# Altium schematic sheet PCB_BERRACHED_ZAKARIA_SCHELA_ELECTRIQUE.SchDoc
size A4; SheetNumber: 1; SheetTotal: 1
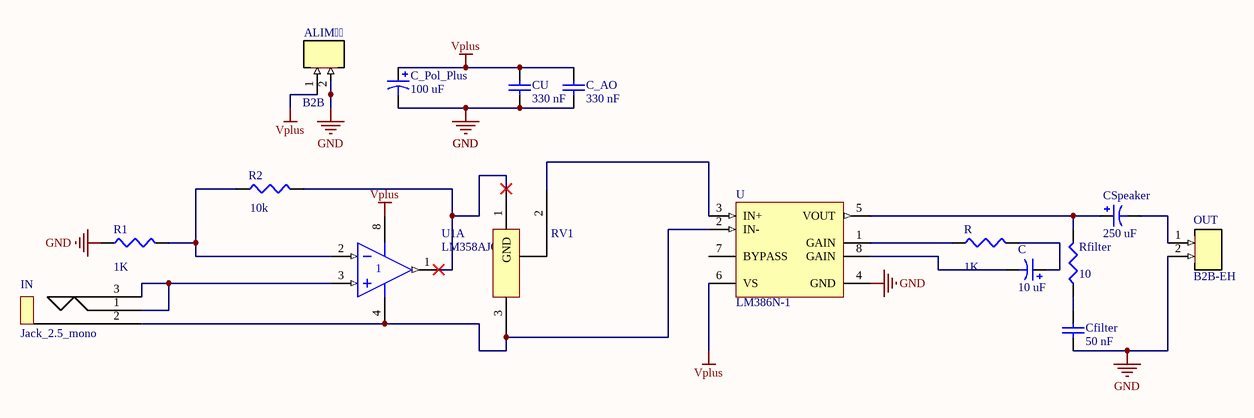
[diagram p0: PCB_BERRACHED_ZAKARIA_SCHELA_ELECTRIQUE.SchDoc]

## Parts
ALIM  B2B  [B2B-EH]
C  value 10 uF  [Cap Radial 3mm pitch]  (hidden comment: Capacitor Axial)
C_AO  value 330 nF  [Cap tantal 5mm pitch]  (hidden comment: Capacitor tantal)
C_Pol_Plus  value 100 uF  [Cap Radial 3mm pitch]
Cfilter  value 50 nF  [Cap tantal 5mm pitch]  (hidden comment: Capacitor tantal)
CSpeaker  value 250 uF  [Cap Radial 3mm pitch]  (hidden comment: Capacitor Axial)
CU  value 330 nF  [Cap tantal 5mm pitch]  (hidden comment: Capacitor tantal)
IN  Jack_2.5_mono  [jack_2.5_mono_v]
OUT  B2B-EH  [B2B-EH]
R  value 1K  [AXIAL-0.3]
R1  value 1K  [AXIAL-0.3]
R2  value 10k  [AXIAL-0.3]
Rfilter  value 10  [AXIAL-0.3]
RV1  TRIMMER VISHAY_63  [Vishay 63M]  (value not drawn)
U  LM386N-1  [N08E]
U1  LM358AJG  [JG008]  (part A of 2)

## Nets
GND: ALIM.2 C_AO.1 C_Pol_Plus.2 Cfilter.2 CU.1 OUT.2 R1.1 U.4(GND)
Vplus: ALIM.1 C_AO.2 C_Pol_Plus.1 CU.2 U.6(VS) U1.8(V+)
NetC_1: C.1 R.2
NetC_2: C.2 U.8(GAIN)
NetCfilter_1: Cfilter.1 Rfilter.1
NetCSpeaker_1: CSpeaker.1 Rfilter.2 U.5(VOUT)
NetCSpeaker_2: CSpeaker.2 OUT.1
NetIN_1: IN.1 IN.3 U1.3(IN+)
NetIN_2: IN.2(GND) RV1.3 U.2(IN-) U1.4(V-)
NetR1_2: R1.2 R2.1 U1.2(IN-)
NetR2_2: R2.2 RV1.1(GND) U1.1(OUT)
NetR_1: R.1 U.1(GAIN)
NetRV1_2: RV1.2 U.3(IN+)

Not connected (* = marked no-connect by the designer): U 7(BYPASS)

## Library data of the parts
ALIM OUT = B2B-EH: 2 pins, 2.5mm pitch; Supplier 1: RSComponents
C C_Pol_Plus CSpeaker = Capacitor Axial: Polarized Capacitor (Axial); Published: 8-Jun-2000; LatestRevisionDate: 17-Jul-2002; LatestRevisionNote: Re-released for DXP Platform.; PackageReference: POLAR0.8; Publisher: Altium Limited; PackageDescription: Polarized Capacitor; 2 Leads
C_AO Cfilter CU = Capacitor tantal: Capacitor; Published: 8-Jun-2000; LatestRevisionDate: 29-May-2009; LatestRevisionNote: IPC-7351 Footprint Added.; PackageReference: C0805; Publisher: Altium Limited; PackageDescription: Chip Capacitor
IN = Jack_2.5_mono: 1501_09; Supplier 1: Farnell; Supplier Part Number 1: 2472271
R R1 R2 Rfilter = Resistor: Published: 8-Jun-2000; LatestRevisionDate: 29-May-2009; LatestRevisionNote: IPC-7351 Footprint Added.; PackageReference: J1-0603; Publisher: Altium Limited; PackageDescription: Chip Resistor
RV1 = TRIMMER VISHAY_63: Variable resistor; Supplier 1: Farnell; Supplier 2: Farnell; Supplier Part Number 1: 9608230; Supplier Part Number 2: 1846609
U = LM386N-1: Low Voltage Audio Power Amplifier, 8-pin MDIP; Manufacturer: National Semiconductor; PackageTopMarking: NSUZXYTTE#*LM*386N-1; PowerWise: N; CompType: Audio IC; Published: 4-Dec-2008; DatasheetVersion: Aug-2000; PackageVersion: revG, May-2006; PackageReference: N08E; Publisher: Altium Limited; PackageDescription: MDIP, .365 x .250 x .130in, 8 Lead, .100in Pitch; Supplier 1: Farnell; Supplier Part Number 1: 9488332; PartNumber: LM386N-1; RoHS: N; PinCount: 8; Code_JEDEC: MS-001-BA; ComponentLink1Description: LM386 Datasheet; ComponentLink1URL: http://www.national.com/ds/LM/LM386.pdf; ComponentLink2Description: LM386 Web Page; ComponentLink2URL: http://www.national.com/pf/LM/LM386.html; ComponentLink3Description: N08E Package Page; ComponentLink3URL: http://www.national.com/packaging/folders/n08e.html
U1 = LM358AJG: Dual Operational Amplifier; Published: 15-Apr-2002; LatestRevisionDate: 04-Mar-2005; LatestRevisionNote: Stylized 3D Model Added.; DatasheetVersion: Aug-1988; PackageVersion: Jan-1995; PackageReference: JG008; Publisher: Altium Limited; PackageDescription: DIP; 8 Leads; Row Spacing 7.62 mm; Pitch 2.54 mm; ComponentLink1Description: Manufacturer Link; ComponentLink1URL: http://www.ti.com/